# Altium schematic sheet 02-Schematic.SchDoc: INITIAL DRAFT
size 431 x 279 mm; Date: 4/2/2025; DrawnBy: PhamGiaKhanh; Engineer: PhamGiaKhanh; Revision: 0.1; SheetNumber: 1; SheetTotal: 1; Project: STM32; ENG_APP_DATE: --/--/--; DSN_APP_DATE: --/--/--; CHK_APP_DATE: --/--/--
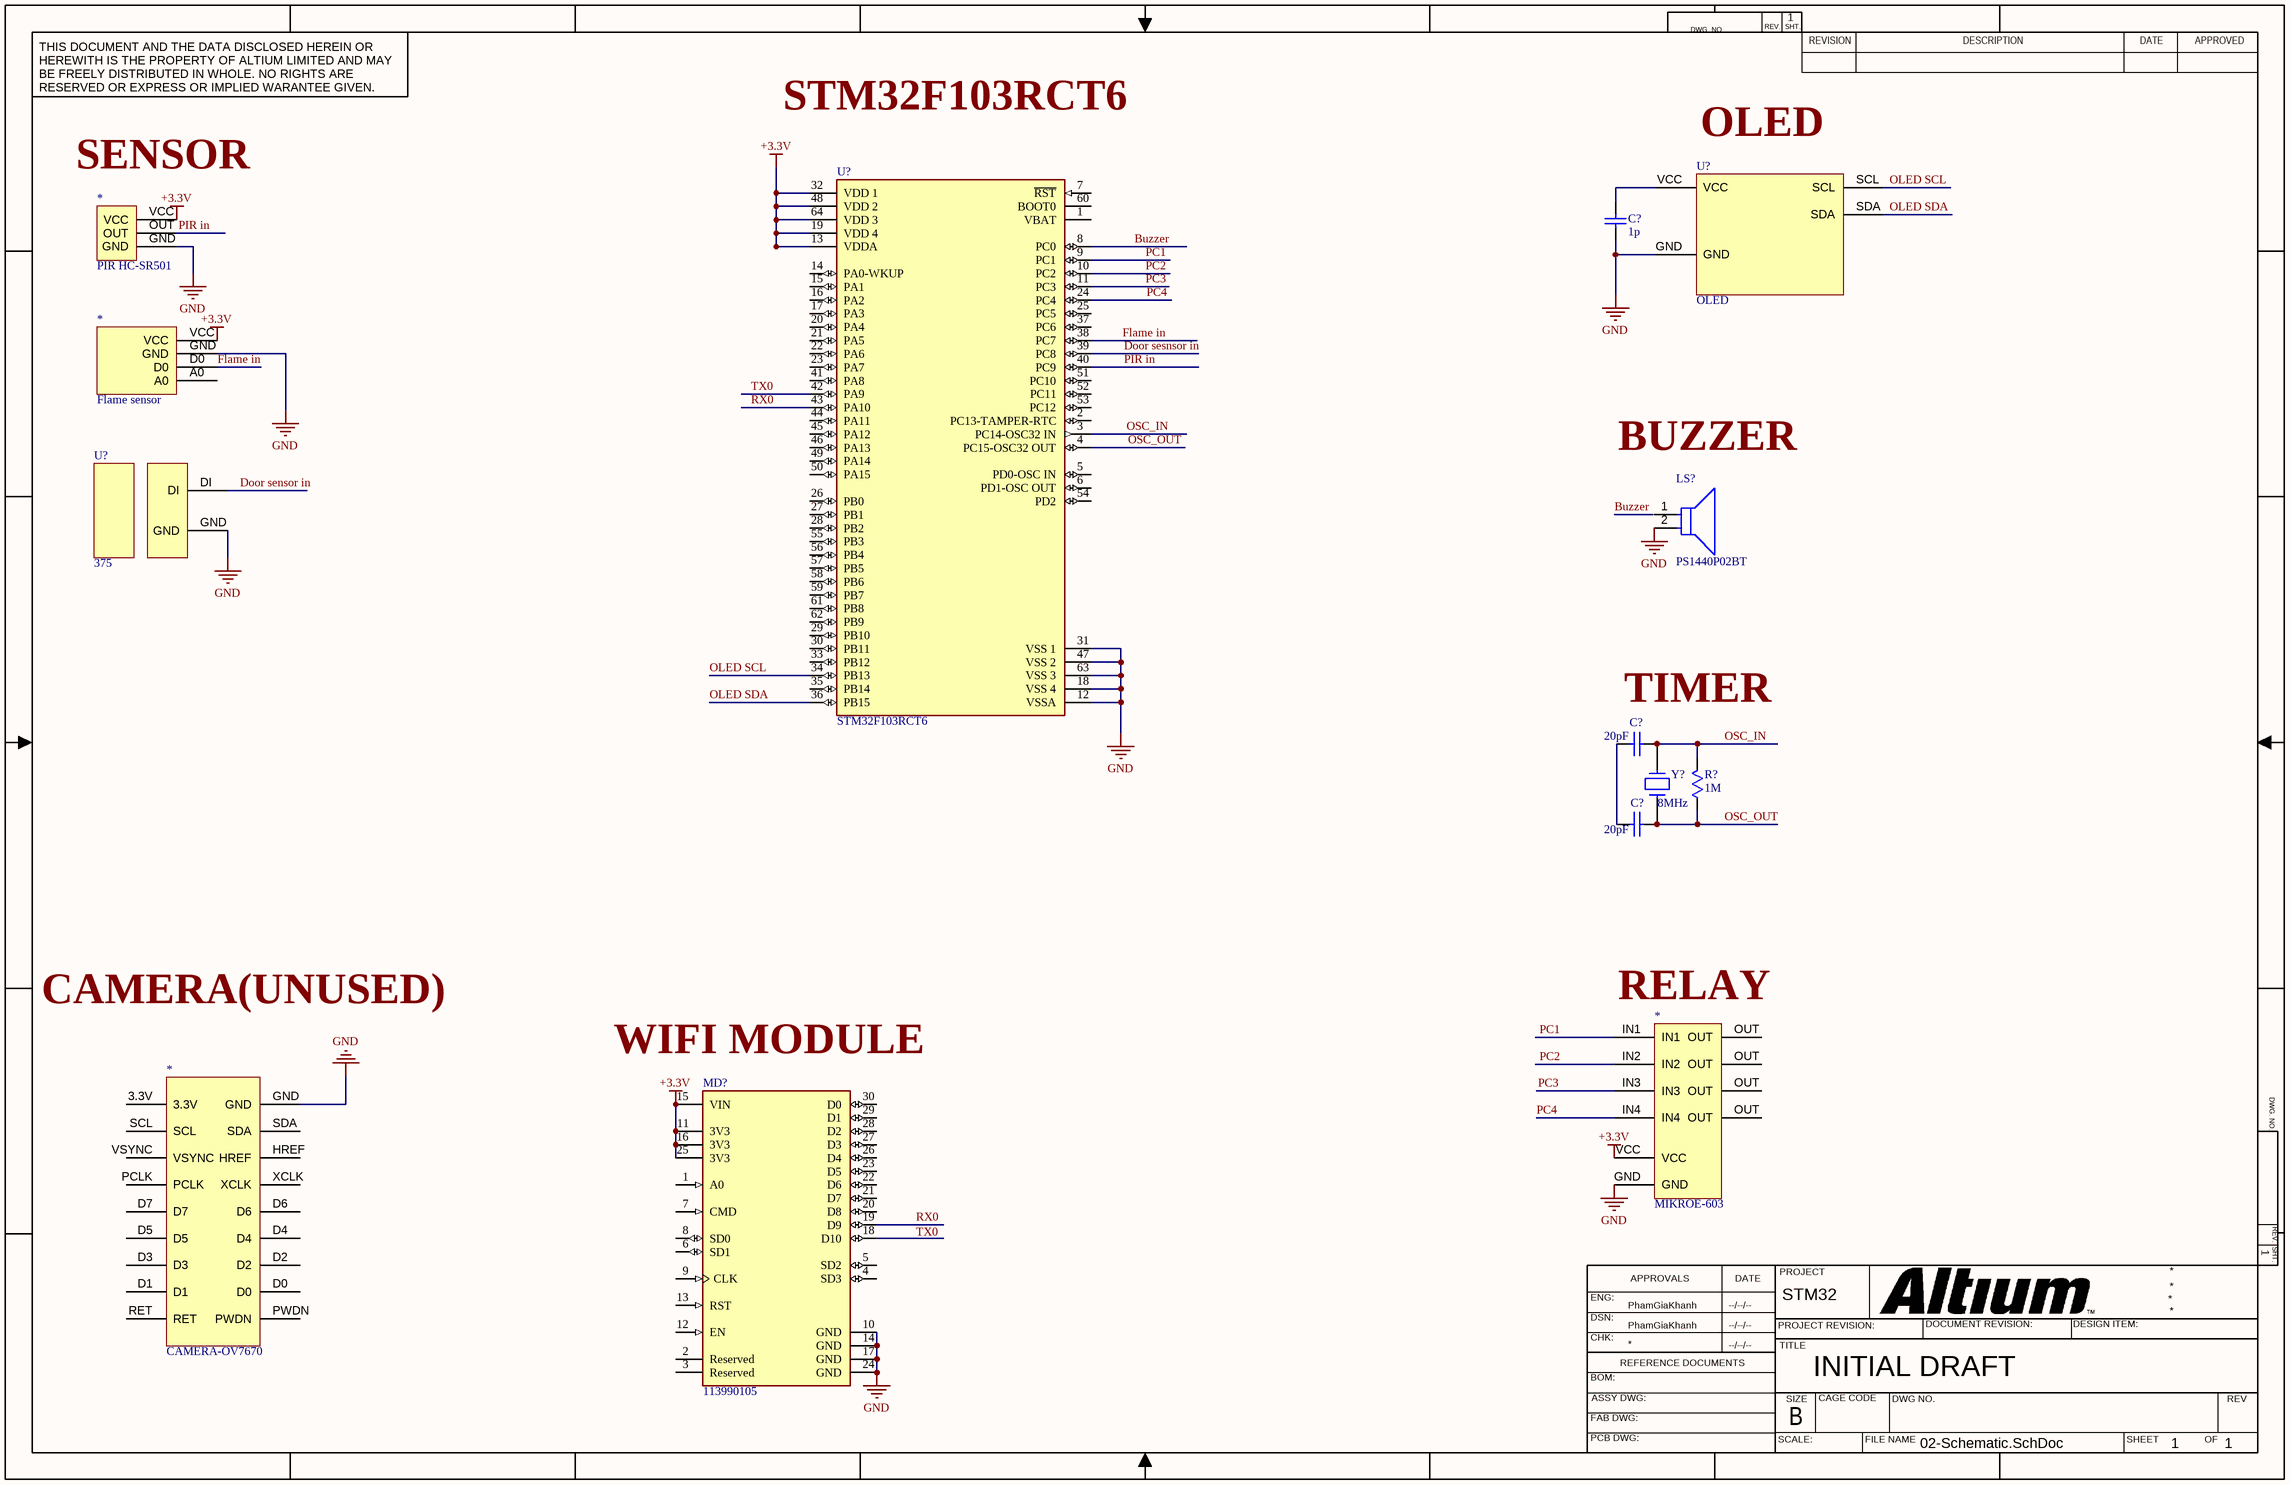
[diagram p0: 02-Schematic.SchDoc]

## Parts
(Parts that share a designator on the sheet are numbered #1, #2 ... from top to bottom, then left to right.)
*#1  PIR HC-SR501
*#2  Flame sensor
*#3  MIKROE-603
*#4  CAMERA-OV7670
C?#1  value 1p  (hidden comment: Capacitor)
C?#2  20pF  [0603J]
C?#3  20pF  [0603J]
LS?  PS1440P02BT  [FP-PS1440P02BT-MFG]
MD?  113990105  [FP-113990105-MFG]
R?  1M  [0603J]
U?#1  STM32F103RCT6  [FP-LQFP64-5W-MFG]
U?#2  OLED
U?#3  375
Y?  8MHz  [smt-xtal]

## Nets
+3.3V: *#1.VCC *#2.VCC *#3.VCC MD?.11(3V3) MD?.15(VIN) MD?.16(3V3) MD?.25(3V3) U?#1.13(VDDA) U?#1.19(VDD_4) U?#1.32(VDD_1) U?#1.48(VDD_2) U?#1.64(VDD_3)
GND: *#1.GND *#2.GND *#3.GND *#4.GND C?#1.1 LS?.2 MD?.10(GND) MD?.14(GND) MD?.17(GND) MD?.24(GND) U?#1.12(VSSA) U?#1.18(VSS_4) U?#1.31(VSS_1) U?#1.47(VSS_2) U?#1.63(VSS_3) U?#2.GND U?#3.GND
Buzzer: U?#1.8(PC0)
Door sensor in: U?#3.DI
Door sesnsor in: U?#1.39(PC8)
Flame in: *#2.D0 U?#1.38(PC7)
OLED SCL: U?#1.34(PB13) U?#2.SCL
OLED SDA: U?#1.36(PB15) U?#2.SDA
OSC_IN: C?#2.2 R?.2 U?#1.3(PC14-OSC32_IN) Y?.1
OSC_OUT: C?#3.2 R?.1 U?#1.4(PC15-OSC32_OUT) Y?.2
PC1: *#3.IN1 U?#1.9(PC1)
PC2: *#3.IN2 U?#1.10(PC2)
PC3: *#3.IN3 U?#1.11(PC3)
PC4: *#3.IN4 U?#1.24(PC4)
PIR in: *#1.OUT U?#1.40(PC9)
RX0: MD?.19(D9) U?#1.43(PA10)
TX0: U?#1.42(PA9)
NetC?#1_2: C?#1.2 U?#2.VCC
NetC?#2_1: C?#2.1 C?#3.1

Not connected (* = marked no-connect by the designer): *#2 A0; *#3 OUT; *#4 3.3V D0 D1 D2 D3 D4 D5 D6 D7 HREF PCLK PWDN RET SCL SDA VSYNC XCLK; LS? 1; MD? 1(A0) 2(Reserved) 3(Reserved) 4(SD3) 5(SD2) 6(SD1) 7(CMD) 8(SD0) 9(CLK) 12(EN) 13(RST) 18(D10) 20(D8) 21(D7) 22(D6) 23(D5) 26(D4) 27(D3) 28(D2) 29(D1) 30(D0); U?#1 1(VBAT) 2(PC13-TAMPER-RTC) 5(PD0-OSC_IN) 6(PD1-OSC_OUT) 7(~{RST}) 14(PA0-WKUP) 15(PA1) 16(PA2) 17(PA3) 20(PA4) 21(PA5) 22(PA6) 23(PA7) 25(PC5) 26(PB0) 27(PB1) 28(PB2) 29(PB10) 30(PB11) 33(PB12) 35(PB14) 37(PC6) 41(PA8) 44(PA11) 45(PA12) 46(PA13) 49(PA14) 50(PA15) 51(PC10) 52(PC11) 53(PC12) 54(PD2) 55(PB3) 56(PB4) 57(PB5) 58(PB6) 59(PB7) 60(BOOT0) 61(PB8) 62(PB9)

## Notes on the sheet
- STM32F103RCT6
- (near U?#2) OLED
- (near *#1) SENSOR
- BUZZER
- (near C?#2) TIMER
- CAMERA(UNUSED)
- (near *#3) RELAY
- (near MD?) WIFI MODULE
- Labels drawn without touching a wire or pin: TX0
- DWG. NO.
- REV.
- SHT.
- THIS DOCUMENT AND THE DATA DISCLOSED HEREIN OR HEREWITH IS THE PROPERTY OF ALTIUM LIMITED AND MAY BE FREELY DISTRIBUTED IN WHOLE. NO RIGHTS ARE RESERVED OR EXPRESS OR IMPLIED WARANTEE GIVEN.
- REVISION
- DESCRIPTION
- DATE
- APPROVED
- ENG:
- APPROVALS
- PROJECT
- DSN:
- CHK:
- REFERENCE DOCUMENTS
- PROJECT REVISION:
- TITLE
- DOCUMENT REVISION:
- DESIGN ITEM:
- BOM:
- FAB DWG:
- PCB DWG:
- ASSY DWG:
- SCALE:
- SIZE
- B
- CAGE CODE
- FILE NAME
- DWG NO.
- SHEET
- OF
- REV

## Library data of the parts
*#3 = MIKROE-603: ULN2804 Darlington BJT Extension Board; Manufacturer: mikroElektronika; Supplier: Digikey; Supplier Part Number: 1471-1247-ND; Manufacturer Part Number: MIKROE-603; RoHS: Yes; Category: Embedded Processors and Controllers; Stock: 19; Pricing: 1=36 (USD); ComponentLink1URL: https://datasheet.ciiva.com/4431/relay4-manual-v100-12328-4431692.pdf?src-supplier=Mouser; ComponentLink1Description: https://datasheet.ciiva.com/4431/relay4-manual-v100-12328-4431692.pdf?src-supplier=Mouser; ComponentLink2URL: https://datasheet.ciiva.com/46642/70377666-46642775.pdf?src-supplier=Allied+Electronics; ComponentLink2Description: https://datasheet.ciiva.com/46642/70377666-46642775.pdf?src-supplier=Allied+Electronics; ComponentLink3URL: https://datasheet.ciiva.com/29357/relay4-manual-v100-29357142.pdf?src-supplier=Digikey; ComponentLink3Description: https://datasheet.ciiva.com/29357/relay4-manual-v100-29357142.pdf?src-supplier=Digikey
*#4 = CAMERA-OV7670: Manufacturer: Olimex; Supplier: Digikey; Supplier Part Number: 1188-CAMERA-OV7670-ND; Manufacturer Part Number: CAMERA-OV7670; RoHS: No; Stock: 23; Pricing: 1=5,17 (USD)
C?#1 = Capacitor: SimulationGenericComponent: True
C?#2 C?#3 = CAP: CAP CHIP 20P 50V(+-5% C0G 0603); Value: 20pF
LS? = CMP-08413-000003-1: AUDIO PIEZO TRANSDUCER 30V TH; Self Resonant Frequency: 4kHz; Washable: No; Voltage Rating (DC): 3V; Number of Terminals/Pins: 2; Packaging: Tape and Reel; Lead Free: Lead Free; Min Operating Temperature: -10°C; Package Quantity: 350; Termination: PC Pins; Mount: Through Hole; Max Operating Temperature: 70°C; Operating Supply Voltage: 3V; Diameter: 14mm; RoHS Compliant: Yes; Frequency: 4kHz; Height: 8mm
MD? = CMP-138991-000001-1: NODEMCU V2 LUA BASED ESP8266 DEV; Frequency: 2.4GHz; Series: -
R? = RES
U?#1 = CMP-0237-00009-5: IC MCU 32BIT 256KB FLASH 64LQFP; Interface: I2C; Number of I/Os: 51; Number of SPI Channels: 3; Min Supply Voltage: 2V; Peripherals: POR; Max Frequency: 72MHz; Max Power Dissipation: 444mW; Number of Timers/Counters: 8; Data Bus Width: 32b; Number of ADC Channels: 16; RAM Size: 48KB; Max Supply Voltage: 3.6V; Number of I2C Channels: 2; Watchdog Timer: Yes; Oscillator Type: Internal; Core Architecture: ARM; Number of Bits: 32; Package Quantity: 960; REACH SVHC: No SVHC; Width: 10mm; Weight: 0.012088oz; Max Operating Temperature: 85°C; Radiation Hardening: No; Length: 10mm; Height: 1.4mm; Number of Programmable I/O: 51; Frequency: 72MHz; Series: STM32F103RC; Min Operating Temperature: -40°C; Number of PWM Channels: 16; Memory Size: 256KB; Lead Free: Lead Free; Packaging: Tray; Termination: SMD/SMT; RoHS Compliant: Yes; Number of Pins: 64; Case/Package: LQFP; Density: 256KB; Memory Type: FLASH
U?#2 = OLED: MDOB128064V2V-YI
U?#3 = 375: Magnetic Contact Switch (Door Sensor) Rohs Compliant: Yes |Adafruit 375; Manufacturer: Adafruit Industries; Supplier: Digikey; Supplier Part Number: 1528-1907-ND; Manufacturer Part Number: 375; RoHS: No; Stock: 162; Pricing: 1=3,95 (USD); ComponentLink1URL: https://media.digikey.com/pdf/Data%20Sheets/Adafruit%20PDFs/375_Web.pdf?src-supplier=Digikey; ComponentLink1Description: https://media.digikey.com/pdf/Data%20Sheets/Adafruit%20PDFs/375_Web.pdf?src-supplier=Digikey
Y? = CRYSTAL: Crystal 8MHz PLUG; Value: 8MHz